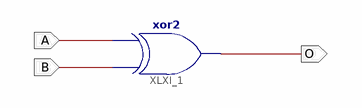
[diagram p0: schematic sheet 1]
// Xilinx ISE schematic MY_XOR_2.sch (spartan3e) as structural Verilog: 1 symbols, 3 ports
module MY_XOR_2 (
  input  A,
  input  B,
  output O
);

  xor XLXI_1 (O, B, A);
endmodule
